# Altium schematic sheet Power_.SchDoc
size A4
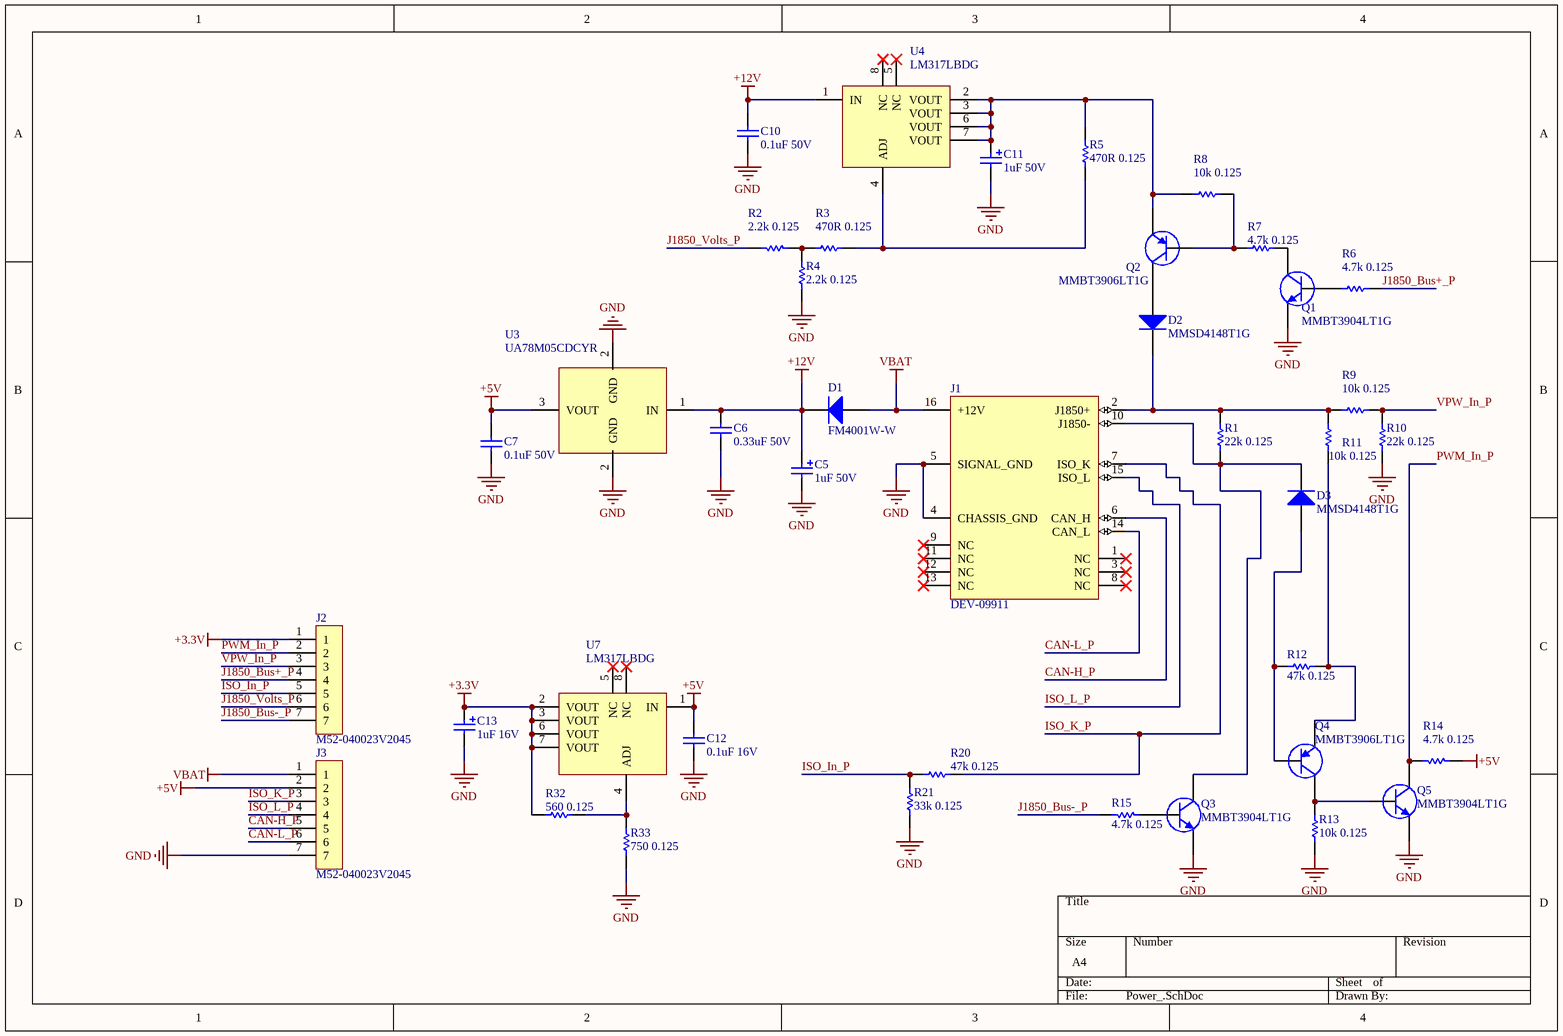
[diagram p0: Power_.SchDoc]

## Parts
C5  1uF 50V  [C1005]
C6  0.33uF 50V  [1608[0603]]
C7  0.1uF 50V  [1608[0603]]
C10  0.1uF 50V  [1608[0603]]
C11  1uF 50V  [C1005]
C12  0.1uF 16V  [1608[0603]]
C13  1uF 16V  [C0603]
D1  FM4001W-W  [SMA,2.8mm]
D2  MMSD4148T1G  [SOD123]
D3  MMSD4148T1G  [SOD123]
J1  DEV-09911  [DEV-09911 - II]
J2  M52-040023V2045  [M52-040023V2045]
J3  M52-040023V2045  [M52-040023V2045]
Q1  MMBT3904LT1G  [SOT23]
Q2  MMBT3906LT1G  [SOT23]
Q3  MMBT3904LT1G  [SOT23]
Q4  MMBT3906LT1G  [SOT23]
Q5  MMBT3904LT1G  [SOT23]
R1  22k 0.125  [ERA-0805]
R2  2.2k 0.125  [ERA-0805]
R3  470R 0.125  [ERA-0805]
R4  2.2k 0.125  [ERA-0805]
R5  470R 0.125  [ERA-0805]
R6  4.7k 0.125  [ERA-0805]
R7  4.7k 0.125  [ERA-0805]
R8  10k 0.125  [ERA-0805]
R9  10k 0.125  [ERA-0805]
R10  22k 0.125  [ERA-0805]
R11  10k 0.125  [ERA-0805]
R12  47k 0.125  [ERA-0805]
R13  10k 0.125  [ERA-0805]
R14  4.7k 0.125  [ERA-0805]
R15  4.7k 0.125  [ERA-0805]
R20  47k 0.125  [ERA-0805]
R21  33k 0.125  [ERA-0805]
R32  560 0.125  [ERA-0805]
R33  750 0.125  [ERA-0805]
U3  UA78M05CDCYR  [SOT223_L]
U4  LM317LBDG  [SOIC8N]
U7  LM317LBDG  [SOIC8N]

## Nets
+3.3V: C13.1 J2.1 R32.1 U7.2(VOUT) U7.3(VOUT) U7.6(VOUT) U7.7(VOUT)
+5V: C7.2 C12.2 J3.2 R14.1 U3.3(VOUT) U7.1(IN)
+12V: C5.1 C6.2 C10.2 D1.2(K) U3.1(IN) U4.1(IN)
GND: C6.1 C7.1 C10.1 C11.2 C12.1 C13.2 J1.4(CHASSIS_GND) J1.5(SIGNAL_GND) J3.7 Q1.2(E) Q3.2(E) Q5.2(E) R4.1 R10.1 R13.2 R21.1 R33.1 U3.2(GND)
VBAT: D1.1(A) J1.16(+12V) J3.1
CAN-H_P: J1.6(CAN_H) J3.5
CAN-L_P: J1.14(CAN_L) J3.6
ISO_In_P: J2.5 R20.1 R21.2
ISO_K_P: J1.7(ISO_K) J3.3 R20.2
ISO_L_P: J1.15(ISO_L) J3.4
J1850_Bus+_P: J2.4 R6.2
J1850_Bus-_P: J2.7 R15.2
J1850_Volts_P: J2.6 R2.2
PWM_In_P: J2.2 Q5.3(C) R14.2
VPW_In_P: J2.3 R9.1 R10.2
NetC11_1: C11.1 Q2.2(E) R5.2 R8.2 U4.2(VOUT) U4.3(VOUT) U4.6(VOUT) U4.7(VOUT)
NetD2_1: D2.1(A) Q2.3(C)
NetD2_2: D2.2(C) J1.2(J1850+) R1.2 R9.2 R11.1
NetD3_1: D3.1(A) Q4.1(B) R12.1
NetD3_2: D3.2(C) J1.10(J1850-) Q3.3(C) R1.1
NetQ1_1: Q1.1(B) R6.1
NetQ1_3: Q1.3(C) R7.2
NetQ2_1: Q2.1(B) R7.1 R8.1
NetQ3_1: Q3.1(B) R15.1
NetQ4_2: Q4.2(E) R11.2 R12.2
NetQ4_3: Q4.3(C) Q5.1(B) R13.1
NetR2_1: R2.1 R3.2 R4.2
NetR3_1: R3.1 R5.1 U4.4(ADJ)
NetR32_2: R32.2 R33.2 U7.4(ADJ)

Not connected (* = marked no-connect by the designer): C5 2; J1 1(NC)* 3(NC)* 8(NC)* 9(NC)* 11(NC)* 12(NC)* 13(NC)*; U4 5(NC)* 8(NC)*; U7 5(NC)* 8(NC)*

## Notes on the sheet
- Labels drawn without touching a wire or pin: GND

## Library data of the parts
C5 C11 = 298D105X0050P2T: Surface-Mount Electrolitic Tantalum Capacitor, 1uF, 20% Tolerance, 1005 Size, 50V; Type: Polarity; PackageReference: 1005; Publisher: Altium Limited; PackageDescription: Chip Capacitor; Site: http://www.vishay.com/doc?40065; Value: 1uF 50V
C6 = C1608X7R1H334K080AC: Surface-Mount Ceramic Multilayer Capacitor, 0.33uF, 10% Tolerance, 0603 Size, 50V; PackageReference: 1608(0603); PackageDescription: Chip Capacitor; Site: http://product.tdk.com/capacitor/mlcc/en/documents/C1608X7R1H334K080AC.pdf; Value: 0.33uF 50V
C7 C10 = C0603C104K5RACTU: Surface-Mount Ceramic Multilayer Capacitor, 0.1uF, 10% Tolerance, 0603 Size, 50V; PackageReference: 1608(0603); PackageDescription: Chip Capacitor; Site: http://www.kemet.com/kemet/web/homepage/kechome.nsf/vapubfiles/KEM_C1002_X7R_SMD.pdf/$file/KEM_C1002_X7R_SMD.pdf; Value: 0.1uF 50V
C12 = GRM188R61C104KA01D: Surface-Mount Ceramic Multilayer Capacitor, 0.1uF, X5R, 10% Tolerance, 0603 Size, 16V; PackageReference: 0603; Publisher: Altium Limited; PackageDescription: Chip Capacitor; Site: http://product.tdk.com/capacitor/mlcc/en/documents/mlccspec_automotive_general_midvoltage_en.pdf; Value: 0.1uF 16V
C13 = 298D105X9016M2T: Surface-Mount Electrolitic Tantalum Capacitor, 1uF, 10% Tolerance, 0603 Size, 16V; Type: Polarity; PackageReference: 0603; Publisher: Altium Limited; PackageDescription: Chip Capacitor; Site: http://www.vishay.com/doc?40065; Value: 1uF 16V
D1 = FM4001W-W: 1 Amp 50V  Rectifier; PackageReference: DO214AC(SMA); ComponentLink1Description: Datasheet; ComponentLink1URL: http://lib.chipdip.ru/758/DOC000758182.pdf; Type: FM4001W-W
D2 D3 = MMSD4148T1G: High Conductance Fast Diode; Manufacturer: OnSemi; Approved: M. Jablonski; TargetLibrary: Diodes; Current: 200 mA; Published: 6/4/2009; Publisher: Vanteon; LeadFree: Yes; RoHS: Yes; PartNumber: MMSD4148T1G; ComponentLink1Description: Datasheet; ComponentLink1URL: http://www.onsemi.com/pub_link/Collateral/MMSD4148T1-D.PDF; Status: Active; Supplier 1: Digi-Key; Supplier Part Number 1: MMSD4148T1GOSCT-ND; Type: MMSD4148T1G
J1 = OBDII_DEV-09911: OBD-II Connector; Manufacturer: SparkFun Electronics; PartNumber: DEV-09911; Type: DEV-09911
J2 J3 = M52-040023V2045: CONN HEADER .050" 50POS PCB GOLD; Manufacturer: Harwin; PartNumber: M52-040023V2045; Type: M52-040023V2045
Q1 Q3 Q5 = MMBT3904LT1G: NPN 3904 General Purpose Amplifier; Manufacturer: ON Semiconductor; Value: 0.2A, 40V; Approved: Yes by Implemenation; TargetLibrary: Transistors; Published: 8/13/2009; Publisher: Vanteon; LeadFree: Yes; RoHS: Yes; PartNumber: MMBT3904LT1G; ComponentLink1Description: Datasheet; ComponentLink1URL: http://www.onsemi.com/pub_link/Collateral/MMBT3904LT1-D.PDF; Status: Active; Supplier 1: Digi-Key; Supplier Part Number 1: MMBT3904LT1GOSCT-ND
Q2 Q4 = MMBT3906LT1G: PNP 3906 General Purpose Amplifier; Manufacturer: ON Semiconductor; Value: 0.2A, -40V; Approved: Yes by Implemenation; TargetLibrary: Transistors; Published: 8/13/2009; Publisher: Vanteon; LeadFree: Yes; RoHS: Yes; PartNumber: MMBT3906LT1G; ComponentLink1Description: Datasheet; ComponentLink1URL: http://www.onsemi.com/pub_link/Collateral/MMBT3906LT1-D.PDF; Status: Active; Supplier 1: Digi-Key; Supplier Part Number 1: MMBT3906LT1GOSCT-ND
R1 R10 = ERA-6AEB223V: Rectangular Thick Film Chip Resistor, 22 kOhm, 0.1% Tolerance, 0805 Size, 0.125 W; Note: If flow soldering, adjust pad width of PCB Footprint to 0.7 - 0.8 times the width of the resistor.; LatestRevisionNote: Silkscreen size reduced.; PackageReference: ERA-0805; Code_IPC: 2012 [0805]; ComponentLink1Description: Manufacturer Link; ComponentLink1URL: http://industrial.panasonic.com/www-data/pdf/AOA0000/AOA0000CE26.pdf; Value: 22k 0.125
R2 R4 = ERA-6AEB222V: Rectangular Thick Film Chip Resistor, 2.2 kOhm, 0.1% Tolerance, 0805 Size, 0.125 W; Note: If flow soldering, adjust pad width of PCB Footprint to 0.7 - 0.8 times the width of the resistor.; LatestRevisionNote: Silkscreen size reduced.; PackageReference: ERA-0805; Code_IPC: 2012 [0805]; ComponentLink1Description: Manufacturer Link; ComponentLink1URL: http://industrial.panasonic.com/www-data/pdf/AOA0000/AOA0000CE26.pdf; Value: 2.2k 0.125
R3 R5 = ERA-6AEB471V: Rectangular Thick Film Chip Resistor, 470 Ohm, 0.1% Tolerance, 0805 Size, 0.125 W; Note: If flow soldering, adjust pad width of PCB Footprint to 0.7 - 0.8 times the width of the resistor.; LatestRevisionNote: Silkscreen size reduced.; PackageReference: ERA-0805; Code_IPC: 2012 [0805]; ComponentLink1Description: Manufacturer Link; ComponentLink1URL: http://industrial.panasonic.com/www-data/pdf/AOA0000/AOA0000CE26.pdf; Value: 470R 0.125
R6 R7 R14 R15 = ERA-6AEB472V: Rectangular Thick Film Chip Resistor, 4.7 kOhm, 0.1% Tolerance, 0805 Size, 0.125 W; Note: If flow soldering, adjust pad width of PCB Footprint to 0.7 - 0.8 times the width of the resistor.; LatestRevisionNote: Silkscreen size reduced.; PackageReference: ERA-0805; Code_IPC: 2012 [0805]; ComponentLink1Description: Manufacturer Link; ComponentLink1URL: http://industrial.panasonic.com/www-data/pdf/AOA0000/AOA0000CE26.pdf; Value: 4.7k 0.125
R8 R9 R11 R13 = ERA-6AEB103V: Rectangular Thick Film Chip Resistor, 10 kOhm, 0.1% Tolerance, 0805 Size, 0.125 W; Note: If flow soldering, adjust pad width of PCB Footprint to 0.7 - 0.8 times the width of the resistor.; LatestRevisionNote: Silkscreen size reduced.; PackageReference: ERA-0805; Code_IPC: 2012 [0805]; ComponentLink1Description: Manufacturer Link; ComponentLink1URL: http://industrial.panasonic.com/www-data/pdf/AOA0000/AOA0000CE26.pdf; Value: 10k 0.125
R12 R20 = ERA-6AEB473V: Rectangular Thick Film Chip Resistor, 47 kOhm, 0.1% Tolerance, 0805 Size, 0.125 W; Note: If flow soldering, adjust pad width of PCB Footprint to 0.7 - 0.8 times the width of the resistor.; LatestRevisionNote: Silkscreen size reduced.; PackageReference: ERA-0805; Code_IPC: 2012 [0805]; ComponentLink1Description: Manufacturer Link; ComponentLink1URL: http://industrial.panasonic.com/www-data/pdf/AOA0000/AOA0000CE26.pdf; Value: 47k 0.125
R21 = ERA-6AEB333V: Rectangular Thick Film Chip Resistor, 33 kOhm, 0.1% Tolerance, 0805 Size, 0.125 W; Note: If flow soldering, adjust pad width of PCB Footprint to 0.7 - 0.8 times the width of the resistor.; LatestRevisionNote: Silkscreen size reduced.; PackageReference: ERA-0805; Code_IPC: 2012 [0805]; ComponentLink1Description: Manufacturer Link; ComponentLink1URL: http://industrial.panasonic.com/www-data/pdf/AOA0000/AOA0000CE26.pdf; Value: 33k 0.125
R32 = ERJ-6ENF5600V: Rectangular Thick Film Chip Resistor, 560 Ohm, 1% Tolerance, 0805 Size, 0.125 W; Note: If flow soldering, adjust pad width of PCB Footprint to 0.7 - 0.8 times the width of the resistor.; LatestRevisionNote: Silkscreen size reduced.; PackageReference: ERA-0805; Code_IPC: 2012 [0805]; ComponentLink1Description: Manufacturer Link; ComponentLink1URL: http://industrial.panasonic.com/www-data/pdf/AOA0000/AOA0000CE26.pdf; Value: 560 0.125
R33 = ERJ-6ENF7500V: Rectangular Thick Film Chip Resistor, 750 Ohm, 1% Tolerance, 0805 Size, 0.125 W; Note: If flow soldering, adjust pad width of PCB Footprint to 0.7 - 0.8 times the width of the resistor.; LatestRevisionNote: Silkscreen size reduced.; PackageReference: ERA-0805; Code_IPC: 2012 [0805]; ComponentLink1Description: Manufacturer Link; ComponentLink1URL: http://industrial.panasonic.com/www-data/pdf/AOA0000/AOA0000CE26.pdf; Value: 750 0.125
U3 = UA78M05CDCYR: 3-terminal regulator 5V in SOT-223; Manufacturer: Texas Instruments; Approved: Yes by Implementation; TargetLibrary: Power IC; PartNumber: UA78M05CDCYR; ComponentLink1Description: Datasheet; ComponentLink1URL: http://www.ti.com/litv/slvs059s; LeadFree: Yes; RoHS: Yes; Status: Active; Supplier 1: Digi-Key; Type: UA78M05CDCYR
U4 U7 = LM317LBDG: 3-terminal adjustable regulator   1.2V-37V 0.1A SOIC8; Manufacturer: National Semiconductor; Approved: Yes by Implementation; TargetLibrary: Power IC; PartNumber: LM317LBDG; Publisher: Vanteon; Published: 8/3/2009; ComponentLink1Description: Datasheet; ComponentLink1URL: http://www.onsemi.com/pub/Collateral/LM317L-D.PDF; LeadFree: Yes; RoHS: Yes; Status: Active; Supplier 1: Digi-Key; Supplier Part Number 1: LM317LM-ND; Type: LM317LBDG